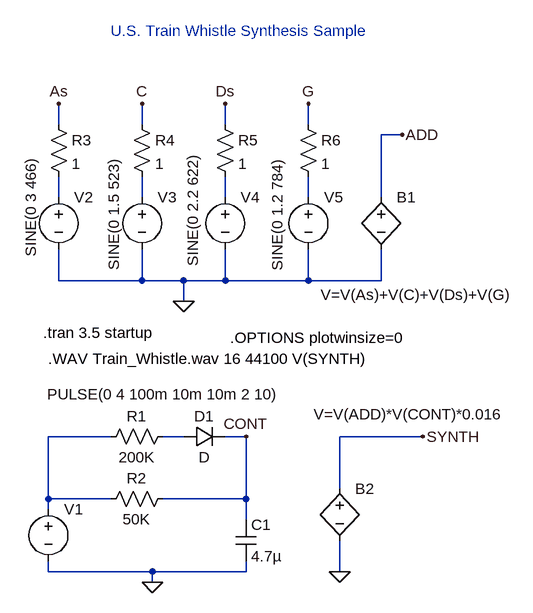
[diagram p0: schematic Fig_9-20_US-train_Sound.asc]
Fig_9-20_US-train_Sound.asc, the LTspice schematic file:
Version 4
SHEET 1 880 868
WIRE -1088 96 -1088 64
WIRE -960 96 -960 64
WIRE -832 96 -832 64
WIRE -704 96 -704 64
WIRE -560 112 -592 112
WIRE -1088 208 -1088 176
WIRE -960 208 -960 176
WIRE -832 208 -832 176
WIRE -704 208 -704 176
WIRE -592 208 -592 112
WIRE -1088 336 -1088 288
WIRE -960 336 -960 288
WIRE -960 336 -1088 336
WIRE -896 336 -960 336
WIRE -832 336 -832 288
WIRE -832 336 -896 336
WIRE -704 336 -704 288
WIRE -704 336 -832 336
WIRE -592 336 -592 288
WIRE -592 336 -704 336
WIRE -896 368 -896 336
WIRE -1008 576 -1104 576
WIRE -896 576 -928 576
WIRE -800 576 -832 576
WIRE -528 576 -656 576
WIRE -656 656 -656 576
WIRE -1104 672 -1104 576
WIRE -1008 672 -1104 672
WIRE -800 672 -800 576
WIRE -800 672 -928 672
WIRE -1104 688 -1104 672
WIRE -800 704 -800 672
WIRE -1104 784 -1104 768
WIRE -944 784 -1104 784
WIRE -800 784 -800 768
WIRE -800 784 -944 784
WIRE -656 784 -656 736
WIRE -944 800 -944 784
FLAG -944 800 0
FLAG -800 576 CONT
FLAG -896 368 0
FLAG -1088 64 As
FLAG -960 64 C
FLAG -832 64 Ds
FLAG -704 64 G
FLAG -560 112 ADD
FLAG -528 576 SYNTH
FLAG -656 784 0
SYMBOL voltage -1104 672 R0
WINDOW 3 -2 -161 Left 2
WINDOW 123 0 0 Left 2
WINDOW 39 0 0 Left 2
SYMATTR Value PULSE(0 4 100m 10m 10m 2 10)
SYMATTR InstName V1
SYMBOL cap -816 704 R0
SYMATTR InstName C1
SYMATTR Value 4.7µ
SYMBOL res -1024 592 R270
WINDOW 0 32 56 VTop 2
WINDOW 3 0 56 VBottom 2
SYMATTR InstName R1
SYMATTR Value 200K
SYMBOL res -1024 688 R270
WINDOW 0 32 56 VTop 2
WINDOW 3 0 56 VBottom 2
SYMATTR InstName R2
SYMATTR Value 50K
SYMBOL diode -896 560 M90
WINDOW 0 0 32 VBottom 2
WINDOW 3 32 32 VTop 2
SYMATTR InstName D1
SYMBOL voltage -1088 192 R0
WINDOW 3 -43 -45 VRight 2
WINDOW 123 0 0 Left 2
WINDOW 39 0 0 Left 2
SYMATTR Value SINE(0 3 466)
SYMATTR InstName V2
SYMBOL voltage -960 192 R0
WINDOW 3 -43 -45 VRight 2
WINDOW 123 0 0 Left 2
WINDOW 39 0 0 Left 2
SYMATTR Value SINE(0 1.5 523)
SYMATTR InstName V3
SYMBOL voltage -832 192 R0
WINDOW 3 -50 -51 VRight 2
WINDOW 123 0 0 Left 2
WINDOW 39 0 0 Left 2
SYMATTR Value SINE(0 2.2 622)
SYMATTR InstName V4
SYMBOL voltage -704 192 R0
WINDOW 3 -48 -44 VRight 2
WINDOW 123 0 0 Left 2
WINDOW 39 0 0 Left 2
SYMATTR Value SINE(0 1.2 784)
SYMATTR InstName V5
SYMBOL bv -592 192 R0
WINDOW 3 -93 166 Left 2
SYMATTR Value V=V(As)+V(C)+V(Ds)+V(G)
SYMATTR InstName B1
SYMBOL bv -656 640 R0
WINDOW 3 -40 -98 Left 2
SYMATTR Value V=V(ADD)*V(CONT)*0.016
SYMATTR InstName B2
SYMBOL res -1104 80 R0
SYMATTR InstName R3
SYMATTR Value 1
SYMBOL res -976 80 R0
SYMATTR InstName R4
SYMATTR Value 1
SYMBOL res -848 80 R0
SYMATTR InstName R5
SYMATTR Value 1
SYMBOL res -720 80 R0
SYMATTR InstName R6
SYMATTR Value 1
TEXT -1112 416 Left 2 !.tran 3.5 startup
TEXT -1104 456 Left 2 !.WAV Train_Whistle.wav 16 44100 V(SYNTH)
TEXT -1008 -48 Left 2 ;U.S. Train Whistle Synthesis Sample
TEXT -824 424 Left 2 !.OPTIONS plotwinsize=0

The netlist it stands for:
* Fig_9-20_US-train_Sound.asc
V1 N005 0 PULSE(0 4 100m 10m 10m 2 10)
C1 CONT 0 4.7µ
R1 N005 N006 200K
R2 N005 CONT 50K
D1 N006 CONT D
V2 N001 0 SINE(0 3 466)
V3 N002 0 SINE(0 1.5 523)
V4 N003 0 SINE(0 2.2 622)
V5 N004 0 SINE(0 1.2 784)
B1 ADD 0 V=V(As)+V(C)+V(Ds)+V(G)
B2 SYNTH 0 V=V(ADD)*V(CONT)*0.016
R3 As N001 1
R4 C N002 1
R5 Ds N003 1
R6 G N004 1
.model D D
.lib standard.dio
.tran 3.5 startup
.WAV Train_Whistle.wav 16 44100 V(SYNTH)
* U.S. Train Whistle Synthesis Sample
.OPTIONS plotwinsize=0
.backanno
.end